# EAGLE schematic side_panels (EAGLE 8.3.1)
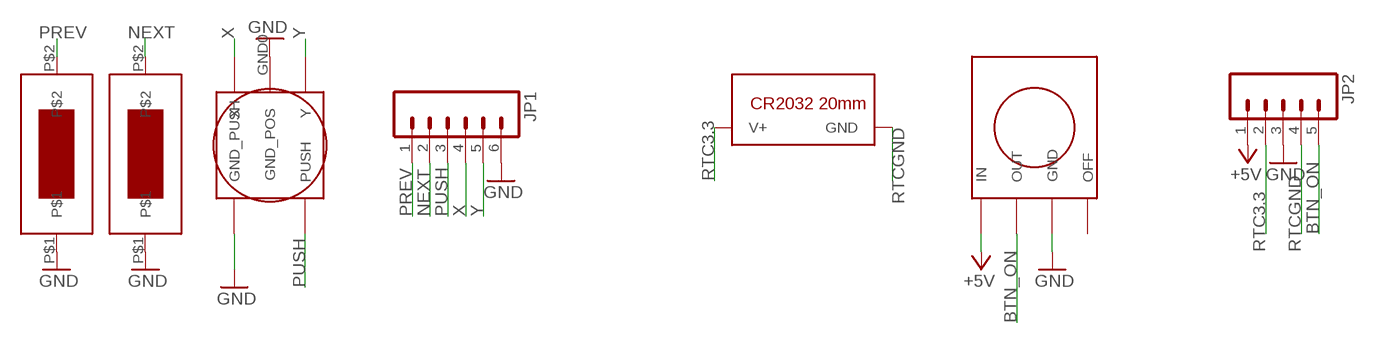
[diagram p0: schematic, sheet 1]

## Parts
JP1  M06  [1X06]
JP2  M05  [1X05]
U$1  MOMENTARY_PUSH  [MOMENTARY_POWER_BUTTON]
U$2  CR2032-20MM-CONN  [CR2032-20MM-CONN]
U$3  ROTARY_ENCODER  [ROTARY_ENCODER]
U$4  MOM_SPST  [MOM_SPST]
U$5  MOM_SPST  [MOM_SPST]

## Nets
+5V: JP2.1 U$1.IN@0(IN) U$1.IN@1(IN)
BTN_ON: JP2.5 U$1.OUT@0(OUT) U$1.OUT@1(OUT)
GND: JP1.6 JP2.3 U$1.GND@0(GND) U$1.GND@1(GND) U$3.GND0(GND_POS) U$3.GND1(GND_PUSH) U$4.P$1 U$5.P$1
NEXT: JP1.2 U$4.P$2
PREV: JP1.1 U$5.P$2
PUSH: JP1.3 U$3.PUSH
RTC3.3: JP2.2 U$2.V+@0(V+) U$2.V+@1(V+)
RTCGND: JP2.4 U$2.GND
X: JP1.4 U$3.X
Y: JP1.5 U$3.Y
Unconnected: U$1.OFF@0(OFF) U$1.OFF@1(OFF)

## Library data of the parts
JP1 = HyTechDevices:M06: Standard 6-pin 0.1" header. NOTES ON THE VARIANTS LOCK and LOCK_LONGPADS... This footprint was designed to help hold the alignment of a through-hole component (i.e. 6-pin header) while soldering it into place. You may notice that each hole has been shifted either up or down by 0.005 of an inch from it's more standard position (which is a perfectly straight line). This slight alteration caused the pins (the squares in the middle) to touch the edges of the holes. Because they are alternating, it causes a "brace" to hold the component in place. 0.005 has proven to be the perfect amount of "off-center" position when using our standard breakaway headers. Although looks a little odd when you look at the bare footprint, once you have a header in there, the alteration is very hard to notice. Also,if you push a header all the way into place, it is covered up entirely on the bottom side. This idea of altering the position of holes to aid alignment will be further integrated into the Sparkfun Library for other footprints. It can help hold any component with 3 or more connection pins. Note: The Sparkfun version includes many other packages including surface mount that may be of future interest. Source: Sparkfun <https://github.com/sparkfun/SparkFun-Eagle-Libraries>
JP2 = HyTechDevices:M05: Standard 5-pin 0.1" header. NOTES ON THE VARIANTS LOCK and LOCK_LONGPADS... This footprint was designed to help hold the alignment of a through-hole component (i.e. 5-pin header) while soldering it into place. You may notice that each hole has been shifted either up or down by 0.005 of an inch from it's more standard position (which is a perfectly straight line). This slight alteration caused the pins (the squares in the middle) to touch the edges of the holes. Because they are alternating, it causes a "brace" to hold the component in place. 0.005 has proven to be the perfect amount of "off-center" position when using our standard breakaway headers. Although looks a little odd when you look at the bare footprint, once you have a header in there, the alteration is very hard to notice. Also,if you push a header all the way into place, it is covered up entirely on the bottom side. This idea of altering the position of holes to aid alignment will be further integrated into the Sparkfun Library for other footprints. It can help hold any component with 3 or more connection pins. Note: The Sparkfun version includes many other packages including surface mount that may be of future interest. Source: Sparkfun <https://github.com/sparkfun/SparkFun-Eagle-Libraries>
U$1 = CH:MOMENTARY_PUSH
U$2 = CH:CR2032-20MM-CONN
U$3 = CH:ROTARY_ENCODER
U$4 U$5 = CH:MOM_SPST